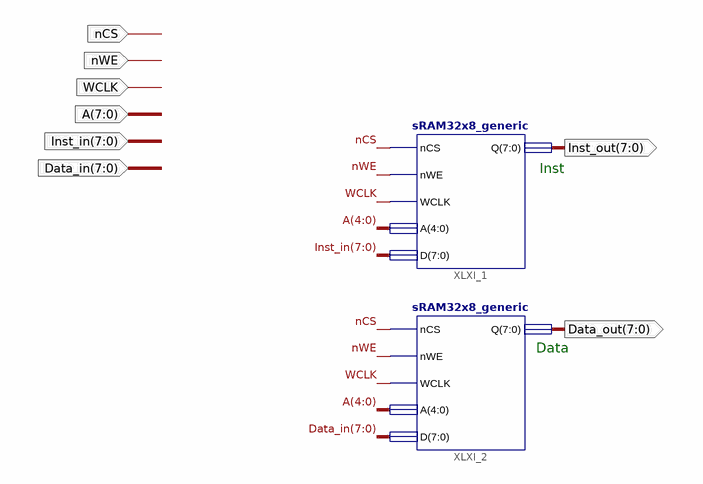
[diagram p0: schematic sheet 1]
// Xilinx ISE schematic MainMem.sch (spartan3e) as structural Verilog: 2 symbols, 8 ports
module MainMem (
  input  nCS,
  input  nWE,
  input  WCLK,
  input  [7:0] A,
  input  [7:0] Inst_in,
  input  [7:0] Data_in,
  output [7:0] Inst_out,
  output [7:0] Data_out
);

  sRAM32x8_generic XLXI_1 (.nCS(nCS), .nWE(nWE), .WCLK(WCLK), .A(A[4:0]), .D(Inst_in), .Q(Inst_out));
  sRAM32x8_generic XLXI_2 (.nCS(nCS), .nWE(nWE), .WCLK(WCLK), .A(A[4:0]), .D(Data_in), .Q(Data_out));

  // Notes on the sheet:
  //   Inst
  //   Data
endmodule
